# Altium schematic sheet ESC_B.SchDoc
size A3; SheetNumber: 8; SheetTotal: 10
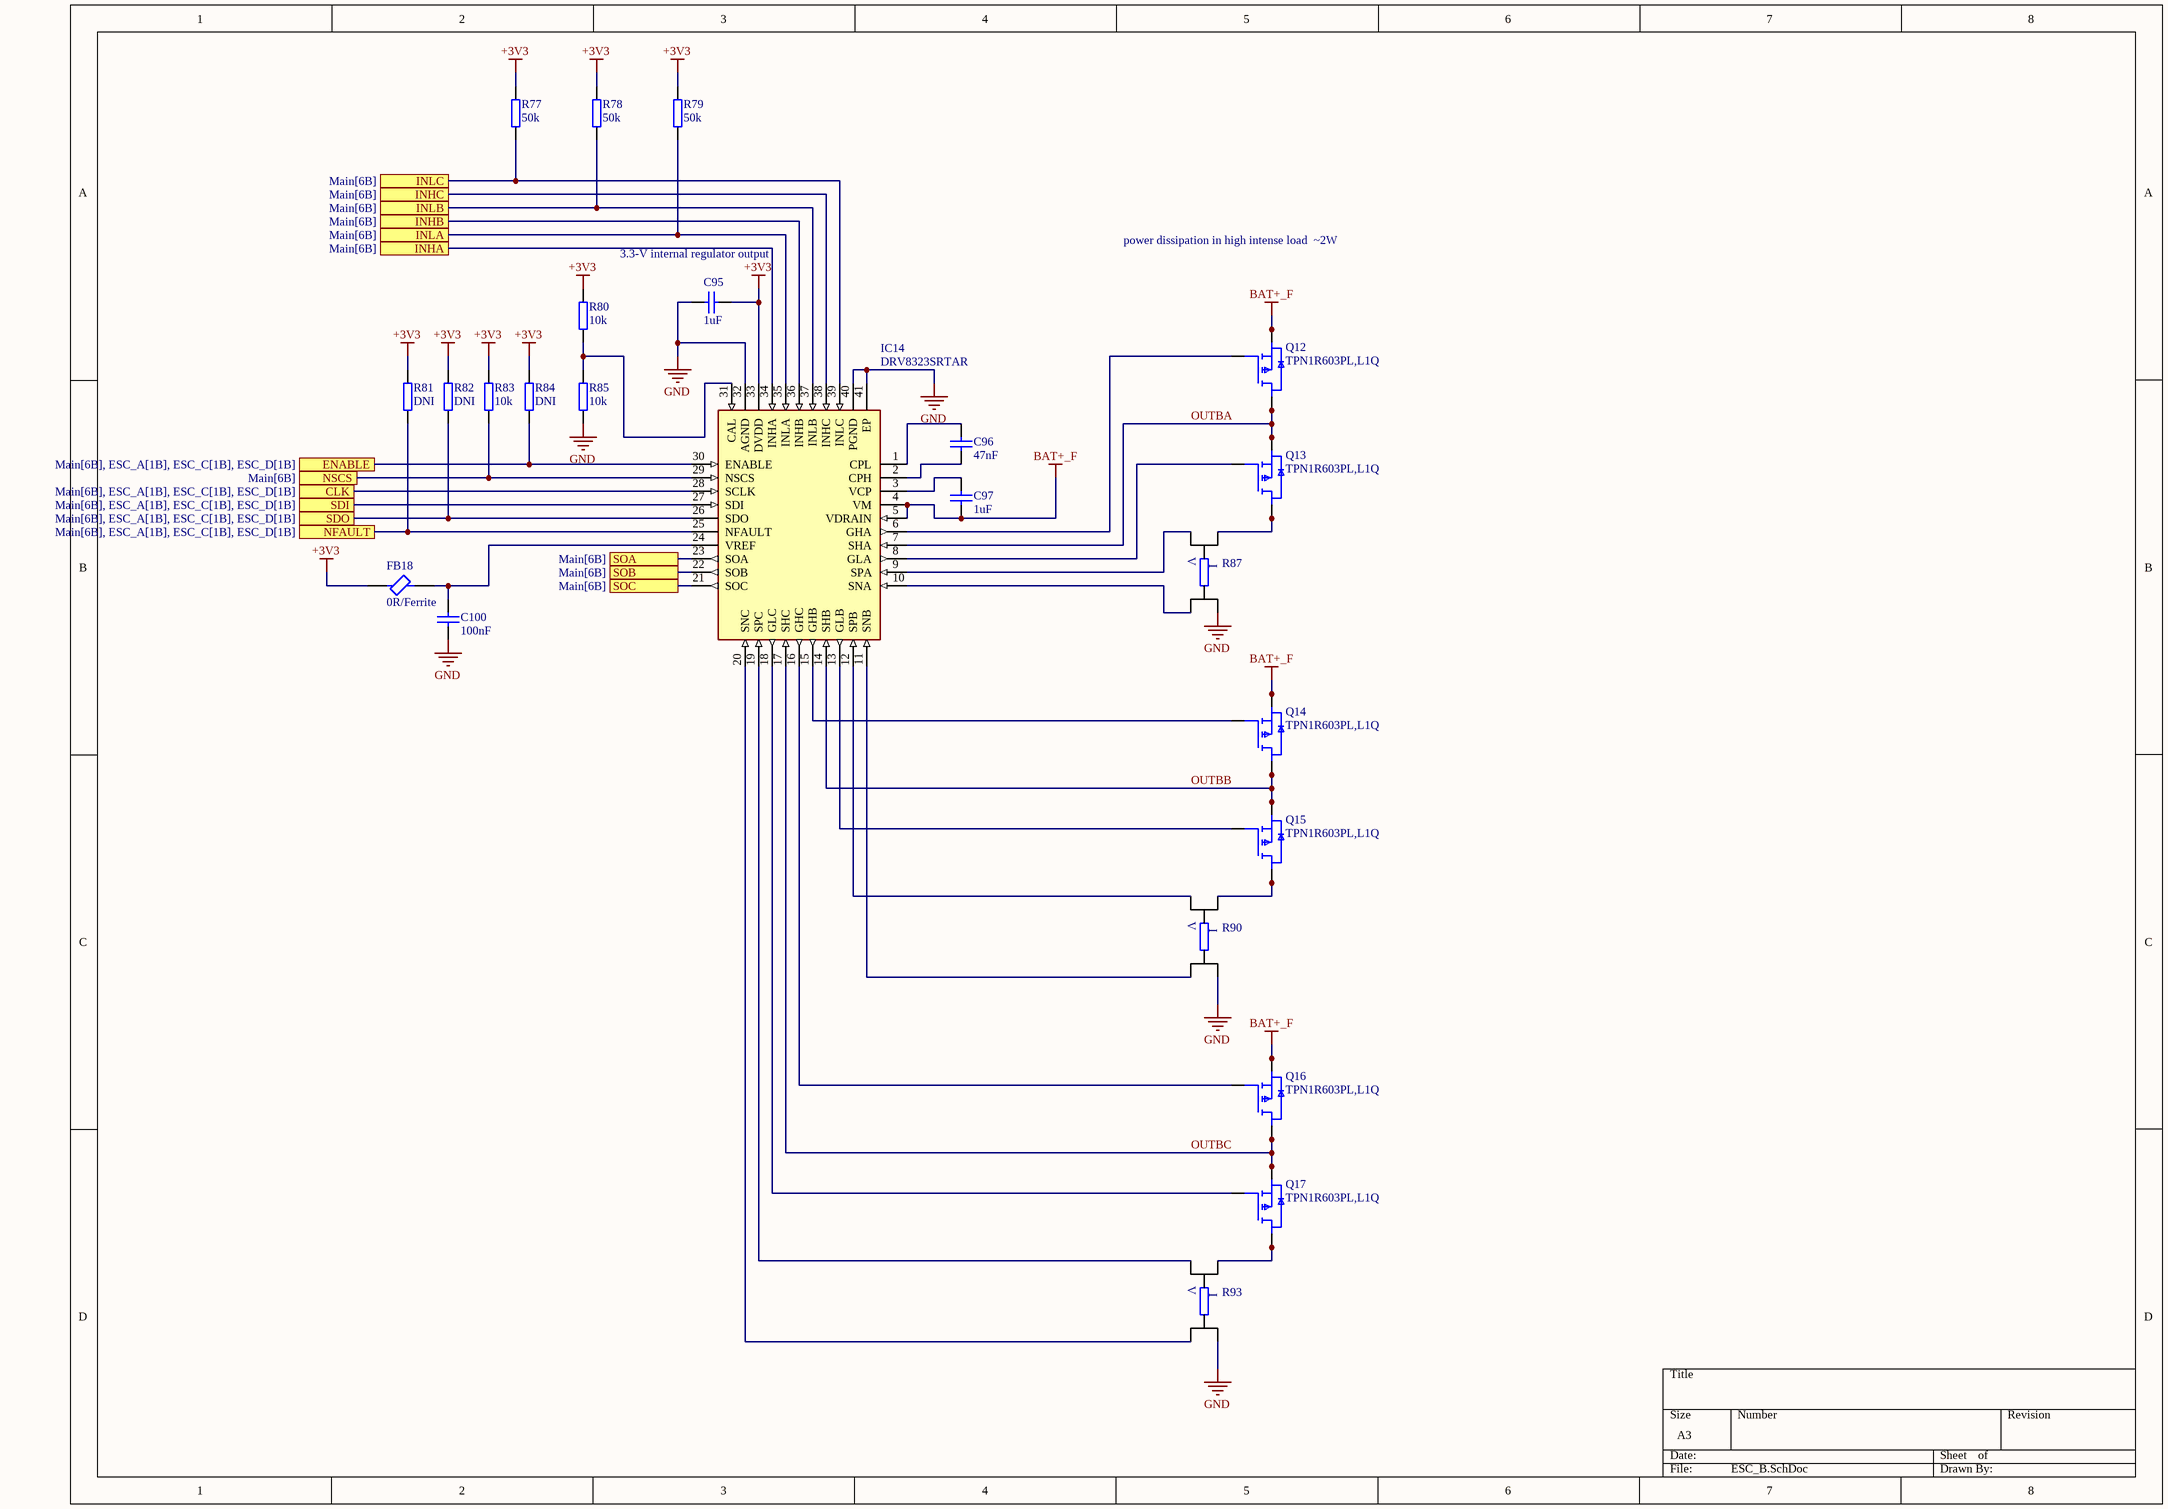
[diagram p0: ESC_B.SchDoc]

## Parts
C95  value 1uF  [CAP0402]  (hidden comment: Cap0402)
C96  value 47nF  [CAP0603]  (hidden comment: CapSMD0603)
C97  value 1uF  [CAP0603]  (hidden comment: CapSMD0603)
C100  value 100nF  [CAP0402]  (hidden comment: Cap0402)
FB18  0R/Ferrite  [NFZ15SG152SN10B]
IC14  DRV8323SRTAR  [QFN50P600X600X80-41N-D]
Q12  TPN1R603PL,L1Q  [TPN1R603PLL1Q]
Q13  TPN1R603PL,L1Q  [TPN1R603PLL1Q]
Q14  TPN1R603PL,L1Q  [TPN1R603PLL1Q]
Q15  TPN1R603PL,L1Q  [TPN1R603PLL1Q]
Q16  TPN1R603PL,L1Q  [TPN1R603PLL1Q]
Q17  TPN1R603PL,L1Q  [TPN1R603PLL1Q]
R77  value 50k  [RES0402]  (hidden comment: Res0402)
R78  value 50k  [RES0402]  (hidden comment: Res0402)
R79  value 50k  [RES0402]  (hidden comment: Res0402)
R80  value 10k  [RES0402]  (hidden comment: Res0402)
R81  value DNI  [RES0402]  (hidden comment: Res0402)
R82  value DNI  [RES0402]  (hidden comment: Res0402)
R83  value 10k  [RES0402]  (hidden comment: Res0402)
R84  value DNI  [RES0402]  (hidden comment: Res0402)
R85  value 10k  [RES0402]  (hidden comment: Res0402)
R87  WSK12161L000FEA  [WSK12161L000FEA]  (value not drawn)
R90  WSK12161L000FEA  [WSK12161L000FEA]  (value not drawn)
R93  WSK12161L000FEA  [WSK12161L000FEA]  (value not drawn)

## Ports
CLK (see Main[6B], ESC_A[1B], ESC_C[1B], ESC_D[1B]), ENABLE (see Main[6B], ESC_A[1B], ESC_C[1B], ESC_D[1B]), INHA (see Main[6B]), INHB (see Main[6B]), INHC (see Main[6B]), INLA (see Main[6B]), INLB (see Main[6B]), INLC (see Main[6B]), NFAULT (see Main[6B], ESC_A[1B], ESC_C[1B], ESC_D[1B]), NSCS (see Main[6B]), SDI (see Main[6B], ESC_A[1B], ESC_C[1B], ESC_D[1B]), SDO (see Main[6B], ESC_A[1B], ESC_C[1B], ESC_D[1B]), SOA (see Main[6B]), SOB (see Main[6B]), SOC (see Main[6B])

## Nets
+3V3: C95.2 FB18.1 IC14.33(DVDD) R77.2 R78.2 R79.2 R80.2 R81.2 R82.2 R83.2 R84.2
BAT+_F: C97.1 IC14.4(VM) IC14.5(VDRAIN) Q12.1(S_1) Q12.2(S_2) Q12.3(S_3) Q14.1(S_1) Q14.2(S_2) Q14.3(S_3) Q16.1(S_1) Q16.2(S_2) Q16.3(S_3)
GND: C95.1 C100.1 IC14.32(AGND) IC14.40(PGND) IC14.41(EP) R85.1 R87.4 R90.4 R93.4
CLK: IC14.28(SCLK) ; port CLK
ENABLE: IC14.30(ENABLE) R84.1 ; port ENABLE
INHA: IC14.34(INHA) ; port INHA
INHB: IC14.36(INHB) ; port INHB
INHC: IC14.38(INHC) ; port INHC
INLA: IC14.35(INLA) R79.1 ; port INLA
INLB: IC14.37(INLB) R78.1 ; port INLB
INLC: IC14.39(INLC) R77.1 ; port INLC
NFAULT: IC14.25(NFAULT) R81.1 ; port NFAULT
NSCS: IC14.29(NSCS) R83.1 ; port NSCS
OUTBA: IC14.7(SHA) Q12.5(D_1) Q12.6(D_2) Q12.7(D_3) Q12.8(D_4) Q12.9(D_4) Q13.1(S_1) Q13.2(S_2) Q13.3(S_3)
OUTBB: IC14.14(SHB) Q14.5(D_1) Q14.6(D_2) Q14.7(D_3) Q14.8(D_4) Q14.9(D_4) Q15.1(S_1) Q15.2(S_2) Q15.3(S_3)
OUTBC: IC14.17(SHC) Q16.5(D_1) Q16.6(D_2) Q16.7(D_3) Q16.8(D_4) Q16.9(D_4) Q17.1(S_1) Q17.2(S_2) Q17.3(S_3)
SDI: IC14.27(SDI) ; port SDI
SDO: IC14.26(SDO) R82.1 ; port SDO
SOA: IC14.23(SOA) ; port SOA
SOB: IC14.22(SOB) ; port SOB
SOC: IC14.21(SOC) ; port SOC
NetC96_1: C96.1 IC14.2(CPH)
NetC96_2: C96.2 IC14.1(CPL)
NetC97_2: C97.2 IC14.3(VCP)
NetC100_2: C100.2 FB18.2 IC14.24(VREF)
NetIC14_6: IC14.6(GHA) Q12.4(G)
NetIC14_8: IC14.8(GLA) Q13.4(G)
NetIC14_9: IC14.9(SPA) R87.2
NetIC14_10: IC14.10(SNA) R87.3
NetIC14_11: IC14.11(SNB) R90.3
NetIC14_12: IC14.12(SPB) R90.2
NetIC14_13: IC14.13(GLB) Q15.4(G)
NetIC14_15: IC14.15(GHB) Q14.4(G)
NetIC14_16: IC14.16(GHC) Q16.4(G)
NetIC14_18: IC14.18(GLC) Q17.4(G)
NetIC14_19: IC14.19(SPC) R93.2
NetIC14_20: IC14.20(SNC) R93.3
NetIC14_31: IC14.31(CAL) R80.1 R85.2
NetQ13_5: Q13.5(D_1) Q13.6(D_2) Q13.7(D_3) Q13.8(D_4) Q13.9(D_4) R87.1
NetQ15_5: Q15.5(D_1) Q15.6(D_2) Q15.7(D_3) Q15.8(D_4) Q15.9(D_4) R90.1
NetQ17_5: Q17.5(D_1) Q17.6(D_2) Q17.7(D_3) Q17.8(D_4) Q17.9(D_4) R93.1

## Notes on the sheet
- power dissipation in high intense load  ~2W
- 3.3-V internal regulator output
- (near IC14) Separate grounds?
- (in symbol WSK1216L5000FEA) V; I

## Library data of the parts
C95 = Cap0402: Voltage: val
C96 C97 = CapSMD0603: 50V; Published: 8-Jun-2000; LatestRevisionDate: 29-May-2009; LatestRevisionNote: IPC-7351 Footprint Added.; PackageReference: C1206; Publisher: Altium Limited; PackageDescription: Chip Capacitor
C100 = Cap0402: Voltage: 6V3
FB18 = BLM15PE471SH1D: Ferrite Bead; Manufacturer_Name: Murata Electronics; Datasheet Link: https://www.murata.com/en-global/products/productdetail.aspx?cate=luNoiseSupprFilteChipFerriBead&partno=BLM15PE471SH1%23; Height: 0.55mm; Manufacturer_Part_Number: BLM15PE471SH1D; Mouser Part Number: 81-BLM15PE471SH1D; Mouser Price/Stock: https://www.mouser.co.uk/ProductDetail/Murata-Electronics/BLM15PE471SH1D?qs=DRkmTr78QATAY5qAVx1hGA%3D%3D
IC14 = DRV8323SRTAR: Integrated Circuit; Manufacturer_Name: Texas Instruments; Datasheet Link: http://www.ti.com/lit/ds/symlink/drv8323.pdf; Height: 0.8mm; Manufacturer_Part_Number: DRV8323SRTAR; Mouser Part Number: 595-DRV8323SRTAR; Mouser Price/Stock: https://www.mouser.co.uk/ProductDetail/Texas-Instruments/DRV8323SRTAR?qs=u4fy%2FsgLU9P2gpPTX6mffg%3D%3D; Arrow Part Number: DRV8323SRTAR; Arrow Price/Stock: https://www.arrow.com/en/products/drv8323srtar/texas-instruments?utm_currency=USD&region=nac
Q12-Q17 = TPN1R603PL,L1Q: MOSFET (N-Channel); Manufacturer_Name: Toshiba; Datasheet Link: https://toshiba.semicon-storage.com/ap-en/semiconductor/product/mosfets/12v-300v-mosfets/detail.TPN1R603PL.html; Height: 0.9mm; Manufacturer_Part_Number: TPN1R603PL,L1Q; Mouser Part Number: 757-TPN1R603PLL1Q; Mouser Price/Stock: https://www.mouser.co.uk/ProductDetail/Toshiba/TPN1R603PLL1Q?qs=bUPhaerQQeGYpGlYi%252BLguw%3D%3D; Arrow Part Number: TPN1R603PL,L1Q; Arrow Price/Stock: https://www.arrow.com/en/products/tpn1r603pll1q/toshiba?utm_currency=USD&region=nac
R87 R90 R93 = WSK1216L5000FEA: Resistor; Manufacturer_Name: Vishay; Datasheet Link: http://www.vishay.com/docs/30189/wsk1216.pdf; Height: 1.9mm; Manufacturer_Part_Number: WSK1216L5000FEA; Mouser Part Number: 71-WSK1216L5000FEA; Mouser Price/Stock: https://www.mouser.co.uk/ProductDetail/Vishay-Dale/WSK1216L5000FEA?qs=OlC7AqGiEDlM2wGD42LFoQ%3D%3D; Arrow Part Number: WSK1216L5000FEA; Arrow Price/Stock: https://www.arrow.com/en/products/wsk1216l5000fea/vishay?region=nac